# EAGLE design I2c_Stm8_Uln (EAGLE 7.5.0)
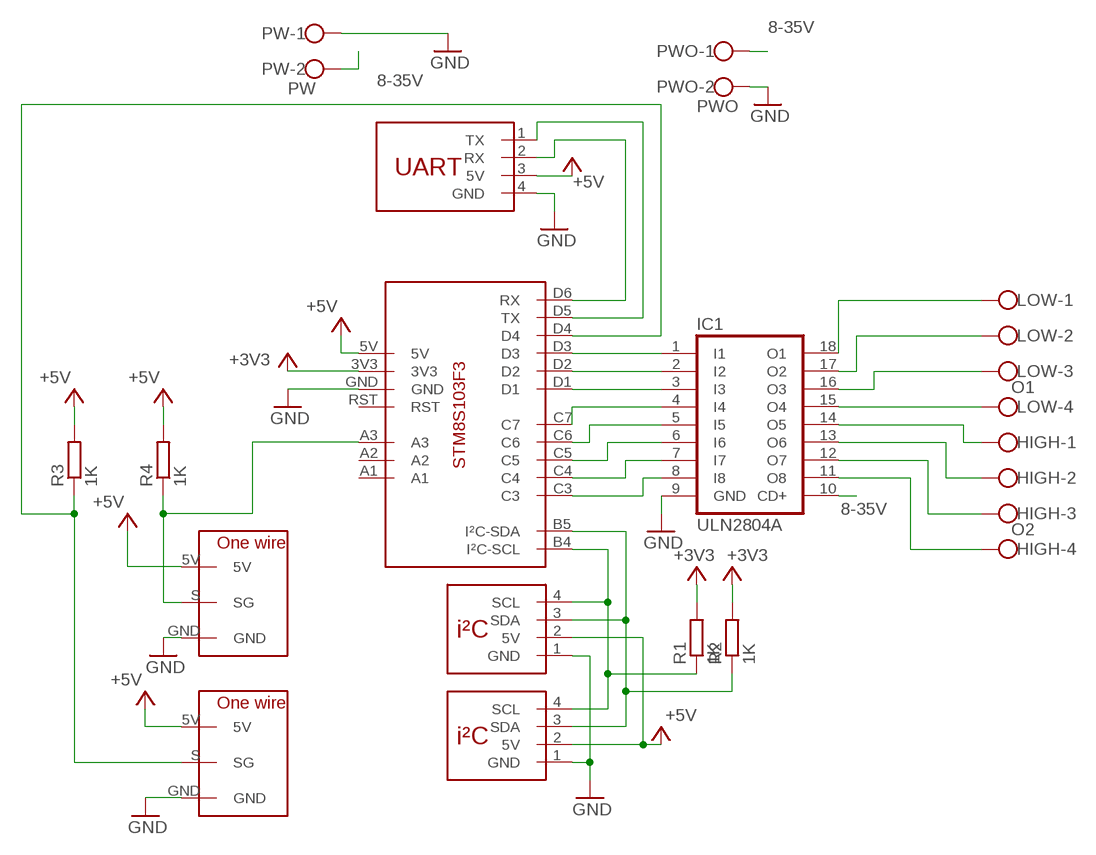
[diagram p0: schematic, sheet 1]

## Parts
HIGH  O2  W237-4  [W237-4]
I2C  I2C  [I2C]
I2C_SHARE  I2C  [I2C]
IC1  ULN2804A  [DIL18]
LOW  O1  W237-4  [W237-4]
PW  PW  W237-102  [W237-102]
PWO  PWO  W237-102  [W237-102]
R1  1K  R-EU_R1206  [R1206]
R2  1K  R-EU_R1206  [R1206]
R3  1K  R-EU_R1206  [R1206]
R4  1K  R-EU_R1206  [R1206]
U$1  STM8S103F3-DEVKIT  [STM8S103F3-DEVKIT]
U$2  ONE_WIRE  [ONE_WIRE]
U$3  UARTBIG  [UART]
U$4  ONE_WIRE  [ONE_WIRE]

## Nets
8-35V: IC1.10(CD+) PW.2 PWO.1
+3V3: R1.2 R2.2 U$1.3V3
+5V: I2C.2(5V) I2C_SHARE.2(5V) R3.2 R4.2 U$1.5V U$2.5V U$3.3(5V) U$4.5V
GND: I2C.1(GND) I2C_SHARE.1(GND) IC1.9(GND) PW.1 PWO.2 U$1.GND U$2.GND U$3.4(GND) U$4.GND
N$1: U$1.D6(RX) U$3.2(RX)
N$2: I2C.4(SCL) I2C_SHARE.4(SCL) R1.1 U$1.B4(I²C-SCL)
N$3: I2C.3(SDA) I2C_SHARE.3(SDA) R2.1 U$1.B5(I²C-SDA)
N$4: U$1.D5(TX) U$3.1(TX)
N$5: IC1.1(I1) U$1.D3
N$6: IC1.2(I2) U$1.D2
N$7: IC1.3(I3) U$1.D1
N$8: IC1.4(I4) U$1.C7
N$9: IC1.5(I5) U$1.C6
N$10: IC1.6(I6) U$1.C5
N$11: IC1.7(I7) U$1.C4
N$12: IC1.8(I8) U$1.C3
N$13: IC1.18(O1) LOW.1
N$14: IC1.17(O2) LOW.2
N$15: IC1.16(O3) LOW.3
N$16: IC1.15(O4) LOW.4
N$17: HIGH.1 IC1.14(O5)
N$18: HIGH.2 IC1.13(O6)
N$19: HIGH.3 IC1.12(O7)
N$20: HIGH.4 IC1.11(O8)
N$22: R3.1 U$1.D4 U$4.S(SG)
N$23: R4.1 U$1.A3 U$2.S(SG)
Unconnected: U$1.A1 U$1.A2 U$1.RST

## Library data of the parts
HIGH LOW = con-wago-500:W237-4: WAGO SCREW CLAMP
I2C I2C_SHARE = WFConnectors:I2C
IC1 = uln-udn:ULN2804A: DRIVER ARRAY
PW PWO = con-wago-500:W237-102: WAGO SCREW CLAMP
R1-R4 = resistor:R-EU_: RESISTOR, European symbol
U$1 = STM8DevKit:STM8S103F3-DEVKIT: Development kit of the STM8S103F3 with a Test Led, power Led and reset button
U$2 U$4 = one-wire:ONE_WIRE
U$3 = WFConnectors:UART

## Board
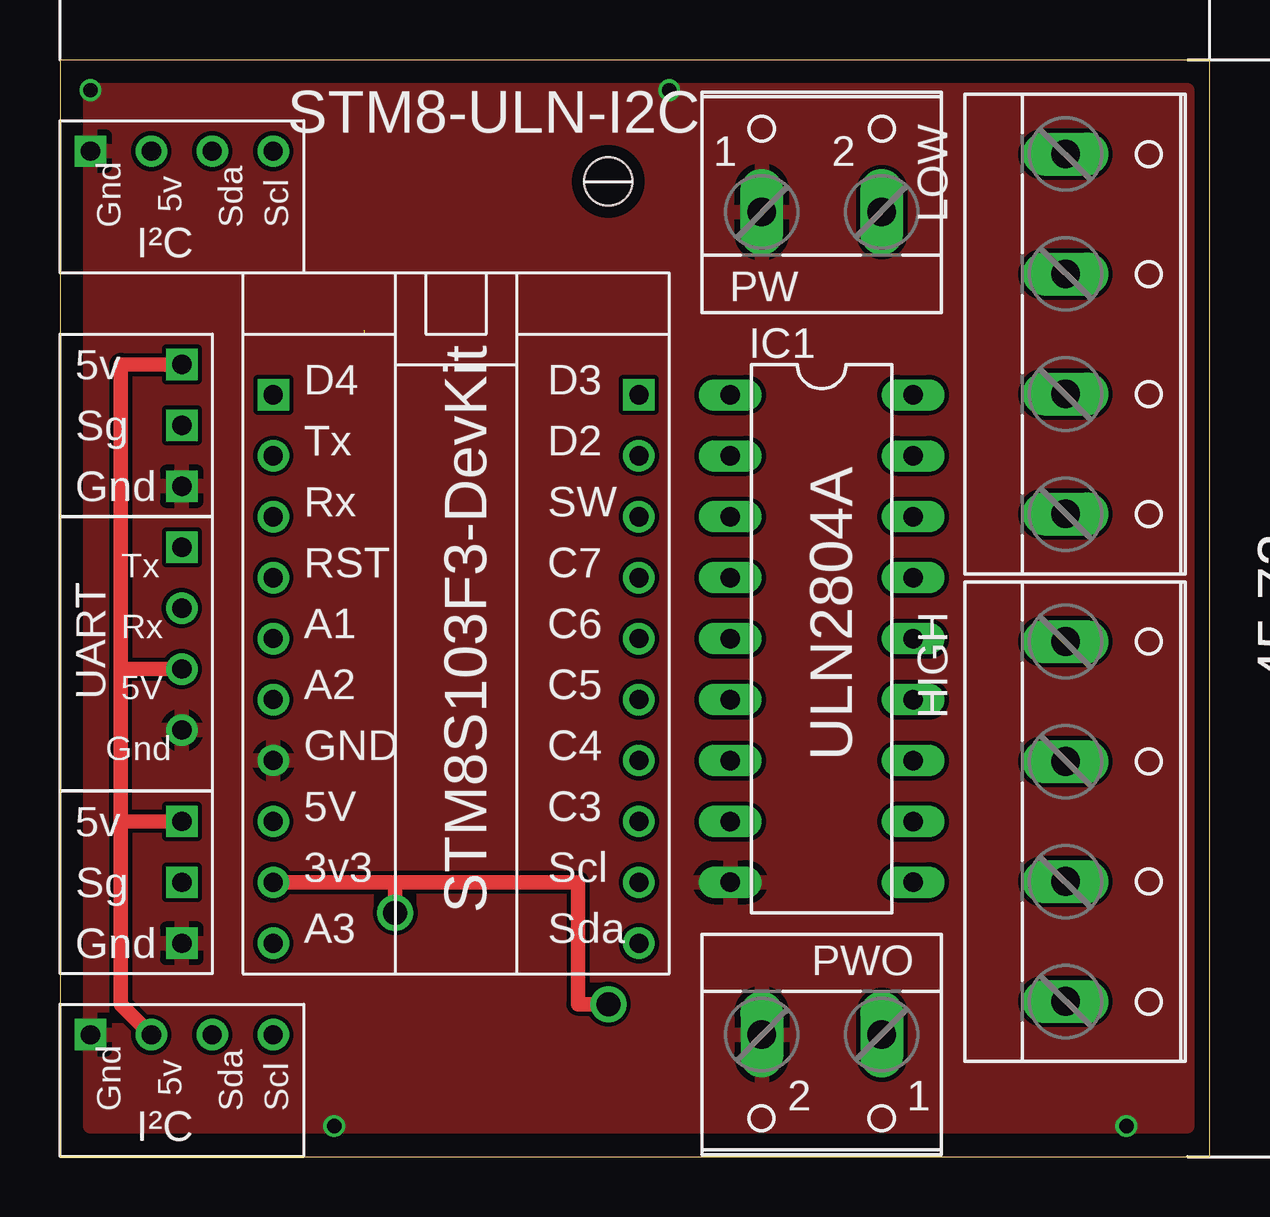
[diagram p1: board, top side]
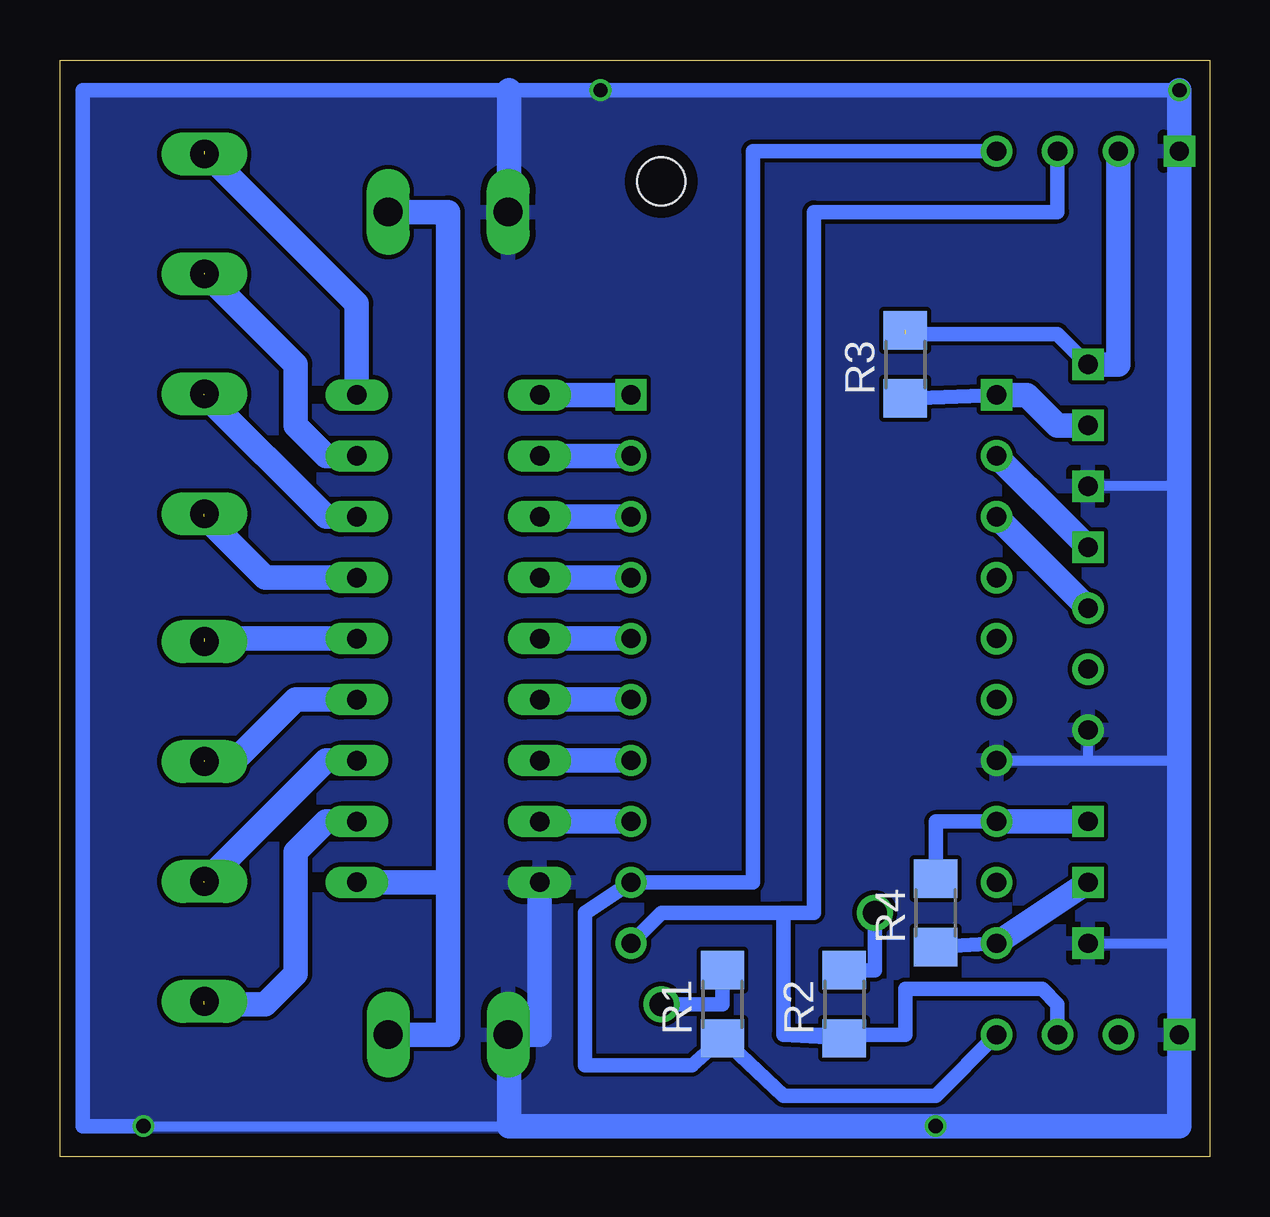
[diagram p2: board, bottom side, seen from below]

Size 47.93 x 45.71 mm. Coordinates in mm from the lower left corner, seen from the top.
Outline: 0,0 47.93,0 47.93,45.71 0,45.71 0,0
Copper layers (1*16): Top 0.035mm / dielectric 1.5mm / Bottom 0.035mm
Design rules "EagleRules": minimum track width 7mil, minimum drill 12mil, track to track 7mil, track to pad 7mil, pad to pad 7mil, via to via 7mil, smd to smd 0mil, copper to edge 20mil, drill to drill 10mil, minimum pad ring 10mil, minimum via ring 6mil, stop-mask expansion 2mil, vias tented up to drill 25mil, thermal gap 10mil
Holes 2 mm at 22.86,40.64

### Footprints (pad centres in the part's own frame; a part is rotated, then mirrored left to right if it is on the bottom)
W237-4 = drill 1.194 long: 1 -7.5,-1.27; 2 -2.5,-1.27; 3 2.5,-1.27; 4 7.5,-1.27
I2C = drill 0.8 square: 1 -1.27,3.81 | drill 0.8: 2 -1.27,1.27; 3 -1.27,-1.27; 4 -1.27,-3.81
DIL18 = drill 0.813 long: 1 -10.16,-3.81; 2 -7.62,-3.81; 3 -5.08,-3.81; 4 -2.54,-3.81; 5 0,-3.81; 6 2.54,-3.81; 7 5.08,-3.81; 8 7.62,-3.81; 9 10.16,-3.81; 10 10.16,3.81; 11 7.62,3.81; 12 5.08,3.81; 13 2.54,3.81; 14 0,3.81; 15 -2.54,3.81; 16 -5.08,3.81; 17 -7.62,3.81; 18 -10.16,3.81
W237-102 = drill 1.194 long: 1 -2.5,-1.27; 2 2.5,-1.27
R1206 = smd 1.6 x 1.803: 1 -1.422,0; 2 1.422,0
STM8S103F3-DEVKIT = drill 0.8: 3V3 -7.62,-10.16; 5V -7.62,-7.62; A1 -7.62,0; A2 -7.62,-2.54; A3 -7.62,-12.7; B4 7.62,-10.16; B5 7.62,-12.7; C3 7.62,-7.62; C4 7.62,-5.08; C5 7.62,-2.54; C6 7.62,0; C7 7.62,2.54; D1 7.62,5.08; D2 7.62,7.62; D5 -7.62,7.62; D6 -7.62,5.08; GND -7.62,-5.08; RST -7.62,2.54 | drill 0.8 square: D3 7.62,10.16; D4 -7.62,10.16
ONE_WIRE = drill 0.8 square: 5V 0,2.54; GND 0,-2.54; S 0,0
UART = drill 0.8 square: 1 0,0 | drill 0.8: 2 0,-2.54; 3 0,-5.08; 4 0,-7.62

### Placement (x,y rotation side)
HIGH  43.18,13.97 270 top
I2C  5.08,6.35 90 top
I2C_SHARE  5.08,43.18 90 top
IC1  31.75,21.59 270 top
LOW  43.18,34.29 270 top
PW  31.75,40.64 0 top
PWO  31.75,3.81 180 top
R1  20.32,6.35 90 bottom
R2  15.24,6.35 90 bottom
R3  12.7,33.02 90 bottom
R4  11.43,10.16 90 bottom
U$1  16.51,21.59 0 top
U$2  5.08,11.43 0 top
U$3  5.08,25.4 0 top
U$4  5.08,30.48 0 top

### Tracks (layer width: path | path; a pad name or v marks a point on that pad's centre or on a via)
8-35V
  Bottom 0.406: PW.2 31.75,39.37 | 31.75,5.08 PWO.1
  Bottom 1.016: 34.29,39.37 31.75,39.37 31.75,11.43 | 31.75,11.43 31.75,5.08 34.29,5.08 | IC1.10 31.75,11.43
+3V3  (via drill 1)
  Top 0.61: U$1.3V3 13.97,11.43 | 13.97,11.43 v13.97,10.16 | 13.97,11.43 21.59,11.43 21.59,6.35 v22.86,6.35
  Bottom 0.61: v13.97,10.16 13.97,7.77 R2.2 | v22.86,6.35 20.32,6.35 R1.2
+5V  (1 unrouted)
  Top 0.61: 2.54,20.32 2.54,33.02 U$4.5V | 2.54,20.32 U$3.3 | 2.54,13.97 2.54,20.32 | U$2.5V 2.54,13.97 | 2.54,13.97 2.54,6.35 I2C.2
  Bottom 0.61: U$1.5V 11.43,13.97 R4.2 | U$4.5V 6.35,34.29 12.7,34.29
  Bottom 1.016: U$4.5V 3.81,33.02 I2C_SHARE.2 | U$1.5V U$2.5V
GND  (via drill 0.6)
  Bottom 0.406: 29.21,44.45 29.25,44.45 | 29.25,44.45 PW.1 | 29.25,44.45 46.99,44.45 | v44.45,1.27 29.25,1.27 | 29.25,1.27 PWO.2 29.21,5.08 | 1.27,1.27 I2C.1 1.27,8.89 | 29.21,1.27 29.25,1.27 | 1.27,8.89 1.27,16.51 | 1.27,16.51 1.27,27.94 | I2C_SHARE.1 1.27,27.94 | 1.27,27.94 U$4.GND | U$2.GND 1.27,8.89 | U$1.GND 5.08,16.51 | 5.08,16.51 1.27,16.51 | U$3.4 5.08,16.51
  Bottom 0.61: v1.27,44.45 v25.4,44.45 29.21,44.45 46.99,44.45 46.99,1.27 v44.45,1.27
  Bottom 1.016: v1.27,44.45 I2C_SHARE.1 1.27,1.27 v11.43,1.27 29.21,1.27 29.21,5.08 27.94,5.08 IC1.9 | 29.21,39.37 29.21,44.45
  pour Top: 1.27,44.45 1.27,1.27 46.99,1.27 46.99,44.45
  pour Bottom: 1.27,44.45 46.99,44.45 46.99,1.27 1.27,1.27
N$1
  Bottom 1.016: U$3.2 U$1.D6
N$2
  Bottom 0.61: I2C_SHARE.4 19.05,41.91 19.05,11.43 U$1.B4 26.04,10.16 26.04,3.81 21.59,3.81 R1.1 17.78,2.54 11.43,2.54 I2C.4
N$3
  Bottom 0.61: I2C_SHARE.3 6.35,39.37 16.51,39.37 16.51,10.16 17.78,10.16 | 17.78,10.16 17.78,5.08 | I2C.3 6.35,6.35 6.99,6.99 12.7,6.99 12.7,5.08 17.78,5.08 | U$1.B5 22.86,10.16 17.78,10.16 | 17.78,5.08 R2.1
N$4
  Bottom 1.016: 6.35,26.67 U$1.D5 U$3.1
N$5
  Bottom 1.016: U$1.D3 IC1.1
N$6
  Bottom 1.016: U$1.D2 IC1.2
N$7
  Bottom 1.016: U$1.D1 IC1.3
N$8
  Bottom 1.016: U$1.C7 IC1.4
N$9
  Bottom 1.016: U$1.C6 IC1.5
N$10
  Bottom 1.016: U$1.C5 IC1.6
N$11
  Bottom 1.016: U$1.C4 IC1.7
N$12
  Bottom 1.016: U$1.C3 IC1.8
N$13  (1 unrouted)
  Bottom 1.016: IC1.18 35.56,35.56 41.91,41.91
N$14  (1 unrouted)
  Bottom 1.016: IC1.17 36.83,29.21 38.1,30.48 38.1,33.02 41.91,36.83
N$15  (1 unrouted)
  Bottom 1.016: IC1.16 36.83,26.67 41.91,31.75
N$16  (1 unrouted)
  Bottom 1.016: IC1.15 39.37,24.13 41.91,26.67
N$17  (1 unrouted)
  Bottom 1.016: IC1.14 41.91,21.59
N$18  (1 unrouted)
  Bottom 1.016: IC1.13 38.1,19.05 40.64,16.51 41.91,16.51
N$19  (1 unrouted)
  Bottom 1.016: IC1.12 36.83,16.51 41.91,11.43
N$20  (1 unrouted)
  Bottom 1.016: IC1.11 36.83,13.97 38.1,12.7 38.1,7.62 39.37,6.35 41.91,6.35
N$22
  Bottom 0.61: U$1.D4 R3.1
  Bottom 1.016: U$4.S 6.35,30.48 7.62,31.75 U$1.D4
N$23
  Bottom 0.61: U$1.A3 R4.1
  Bottom 1.016: U$2.S U$1.A3

### Text on the board
tPlace: STM8-ULN-I2C | ULN2804A